# Altium schematic sheet POWER_12_5_33.SchDoc
size A; SheetNumber: 7; SheetTotal: 9
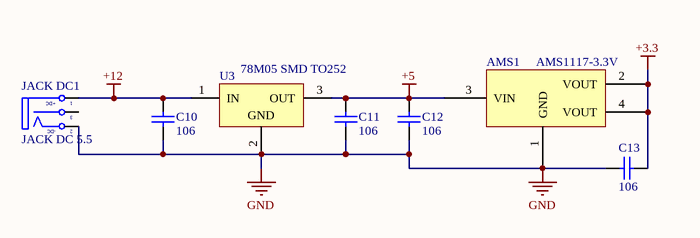
[diagram p0: POWER_12_5_33.SchDoc]

## Parts
AMS1  AMS1117-3.3V  [SOT223]
C10  106  [tu 0603]
C11  106  [tu 0603]
C12  106  [tu 0603]
C13  106  [tu 0603]
JACK_DC1  JACK DC 5.5  [JACK DC 5.5]
U3  78M05 SMD TO252  [TO252]

## Nets
+3.3: AMS1.2(VOUT) AMS1.4(VOUT) C13.2
+5: AMS1.3(VIN) C11.1 C12.2 U3.3(OUT)
+12: C10.1 JACK_DC1.1(T) U3.1(IN)
GND: AMS1.1(GND) C10.2 C11.2 C12.1 C13.1 JACK_DC1.2(TN) U3.2(GND)

Not connected (* = marked no-connect by the designer): JACK_DC1 3(S)

## Notes on the sheet
- (in symbol JACK DC 5.5) +DC; -DC

## Library data of the parts
AMS1 = AMS1117 SMD: Dán; Value: AMS1117-3.3V SOT223; Don_Vi: Con; Ma_Hang: MH000596; Ghi_Chu: *; Kieu_Chan: *; Chung_Loai: Dán
C10-C13 = Tu 0603 106 16V 20%: Dán; Don_Vi: Con; So_Chan: 2; Ten_Linh_Kien: Tụ 0603-10uF 20% 16V; Ma_Hang: MH004848; Chung_Loai: Dán; Kieu_Chan: *
JACK_DC1 = JACK DC 5.5: Value: Jac DC
U3 = 78M05 SMD TO252: Dán; Don_Vi: Con; Ten_Linh_Kien: 78M05 TO252; Ma_Hang: MH001917; Ghi_Chu: *; Kieu_Chan: *; Chung_Loai: Dán